# EAGLE design keybint (EAGLE 8.3.1)
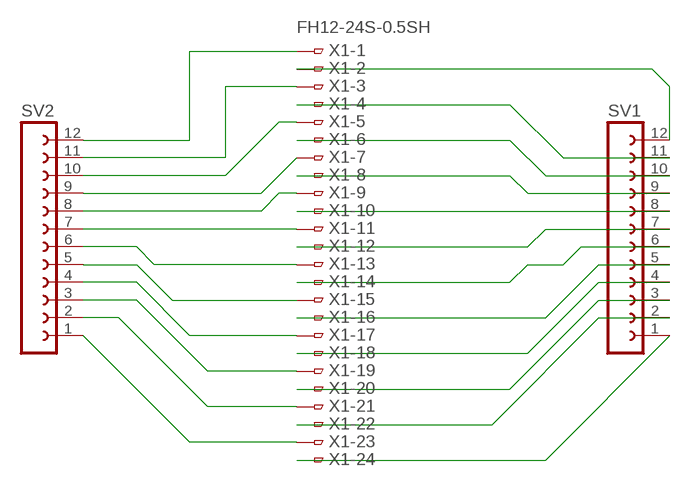
[diagram p0: schematic, sheet 1]

## Parts
SV1  FE12-1  [FE12]
SV2  FE12-1  [FE12]
X1  FH12-24S-0.5SH  [FH12-24S-0.5SH]

## Nets
N$1: SV2.12 X1.1
N$2: SV1.12 X1.2
N$3: SV2.11 X1.3
N$4: SV1.11 X1.4
N$5: SV2.10 X1.5
N$6: SV1.10 X1.6
N$7: SV2.9 X1.7
N$8: SV1.9 X1.8
N$9: SV2.8 X1.9
N$10: SV1.8 X1.10
N$11: SV2.7 X1.11
N$12: SV1.7 X1.12
N$13: SV2.6 X1.13
N$14: SV1.6 X1.14
N$15: SV2.5 X1.15
N$16: SV1.5 X1.16
N$17: SV2.4 X1.17
N$18: SV1.4 X1.18
N$19: SV2.3 X1.19
N$20: SV1.3 X1.20
N$21: SV2.2 X1.21
N$22: SV1.2 X1.22
N$23: SV2.1 X1.23
N$24: SV1.1 X1.24

## Library data of the parts
SV1 SV2 = con-lsta:FE12-1: FEMALE HEADER; OC_FARNELL: unknown; OC_NEWARK: unknown
X1 = con-hirose:FH12-24S-0.5S: 0.5mm Pitch Connectors For FPC/FFC Source: Data sheet <http://www.hirose.co.jp/cataloge_hp/e58605370.pdf>; MPN: FH12-24S-0.5SH(55); OC_FARNELL: 1324552; OC_NEWARK: 34M6170

## Board
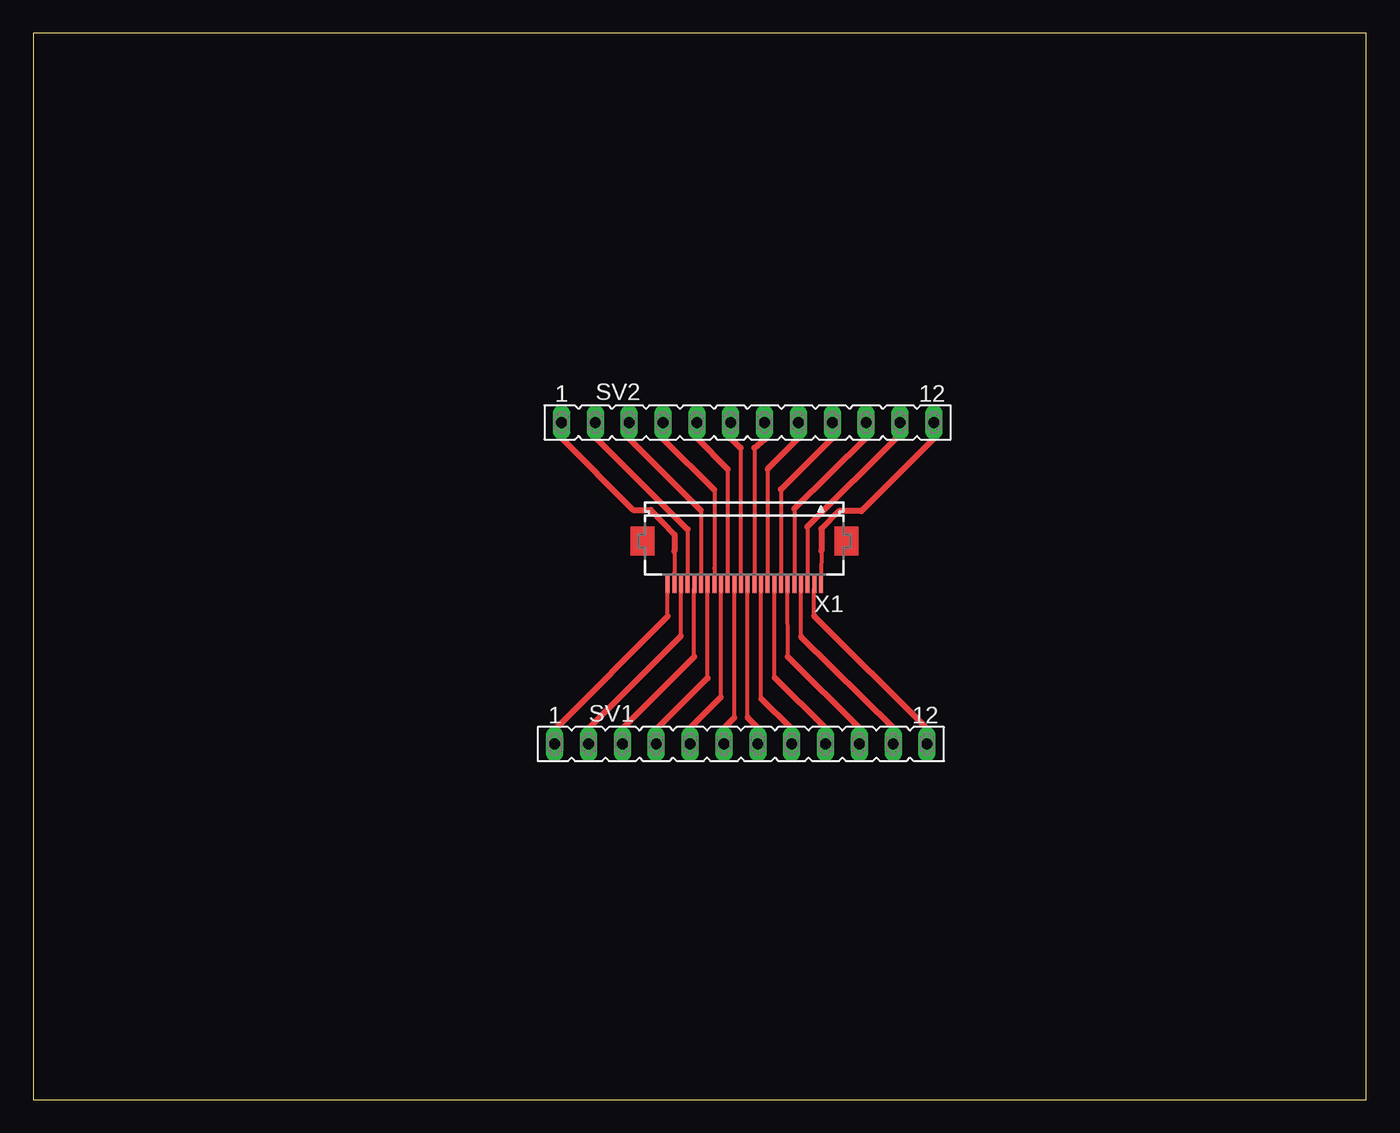
[diagram p1: board, top side]

Size 100 x 80 mm. Coordinates in mm from the lower left corner, seen from the top.
Outline: 0,0 100,0 100,80 0,80 0,0
Copper layers (1*16): Top 0.035mm / dielectric 1.5mm / Bottom 0.035mm
Design rules "default *": minimum track width 12mil, minimum drill 0.35mm, track to track 1mil, track to pad 1mil, pad to pad 1mil, via to via 1mil, smd to smd 1mil, copper to edge 40mil, drill to drill 6mil, minimum pad ring 10mil, minimum via ring 8mil, stop-mask expansion 4mil, vias tented up to drill 0mil, thermal gap 10mil

### Footprints (pad centres in the part's own frame; a part is rotated, then mirrored left to right if it is on the bottom)
FE12 = drill 0.813 long: 1 -13.97,0; 2 -11.43,0; 3 -8.89,0; 4 -6.35,0; 5 -3.81,0; 6 -1.27,0; 7 1.27,0; 8 3.81,0; 9 6.35,0; 10 8.89,0; 11 11.43,0; 12 13.97,0
FH12-24S-0.5SH = smd 0.3 x 1.3: 1 -5.75,3.25; 2 -5.25,3.25; 3 -4.75,3.25; 4 -4.25,3.25; 5 -3.75,3.25; 6 -3.25,3.25; 7 -2.75,3.25; 8 -2.25,3.25; 9 -1.75,3.25; 10 -1.25,3.25; 11 -0.75,3.25; 12 -0.25,3.25; 13 0.25,3.25; 14 0.75,3.25; 15 1.25,3.25; 16 1.75,3.25; 17 2.25,3.25; 18 2.75,3.25; 19 3.25,3.25; 20 3.75,3.25; 21 4.25,3.25; 22 4.75,3.25; 23 5.25,3.25; 24 5.75,3.25

### Placement (x,y rotation side)
SV1  53.09,26.67 0 top
SV2  53.59,50.8 0 top
X1  53.34,41.91 180 top

### Tracks (layer width: path | path; a pad name or v marks a point on that pad's centre or on a via)
N$1
  Top 0.305: 59.13,41.16 59.11,39.31 X1.1 | 67.55,49.58 SV2.12
  Top 0.457: 67.55,49.58 62.13,44.15 60.45,44.15 59.13,42.82 59.13,41.16
N$2
  Top 0.305: 58.59,36.28 58.59,38.1 X1.2 | 67.06,27.84 SV1.12
  Top 0.457: 67.06,27.84 58.59,36.28
N$3
  Top 0.305: 58.06,42.98 58.09,39.41 X1.3 | 64.99,49.87 SV2.11
  Top 0.457: 64.99,49.87 58.06,42.98
N$4
  Top 0.305: 57.59,34.71 57.59,38.08 X1.4 | 64.52,27.86 SV1.11
  Top 0.457: 64.52,27.86 57.59,34.71
N$5
  Top 0.305: 57.1,44.34 57.1,39.38 X1.5 | 62.46,49.64 SV2.10
  Top 0.457: 62.46,49.64 57.1,44.34
N$6
  Top 0.305: 56.6,33.22 56.58,38.1 X1.6 | 61.99,27.86 SV1.10
  Top 0.457: 61.99,27.86 56.6,33.22
N$7
  Top 0.305: 56.08,45.77 56.08,39.46 X1.7 | 59.93,49.59 SV2.9
  Top 0.457: 59.93,49.59 56.08,45.77
N$8
  Top 0.305: 55.61,31.66 55.61,38.1 X1.8 | 59.44,27.86 SV1.9
  Top 0.457: 59.44,27.86 55.61,31.66
N$9
  Top 0.305: 55.09,47.3 55.09,39.36 X1.9 | SV2.8 57.4,50.67 57.38,49.58
  Top 0.457: 57.38,49.58 55.09,47.3
N$10
  Top 0.305: 54.6,30.09 54.6,38.08 X1.10 | 56.9,27.84 SV1.8
  Top 0.457: 56.9,27.84 54.6,30.09
N$11
  Top 0.305: 54.1,48.88 54.1,39.43 X1.11 | 54.86,49.52 SV2.7
  Top 0.457: 54.86,49.52 54.1,48.88
N$12
  Top 0.305: 53.58,28.68 53.58,38.08 X1.12 | 54.37,27.89 SV1.7
  Top 0.457: 54.37,27.89 53.58,28.68
N$13
  Top 0.305: 53.07,48.88 53.07,39.38 X1.13 | 52.34,49.59 SV2.6
  Top 0.457: 52.34,49.59 53.07,48.88
N$14
  Top 0.305: 52.6,28.65 52.6,38.1 X1.14 | 51.82,27.86 SV1.6
  Top 0.457: 51.82,27.86 52.6,28.65
N$15
  Top 0.305: 52.08,47.3 52.08,39.38 X1.15 | 49.81,49.62 SV2.5
  Top 0.457: 49.81,49.62 52.08,47.3
N$16
  Top 0.305: 51.59,30.19 51.59,38.1 X1.16 | 49.26,27.86 SV1.5
  Top 0.457: 49.26,27.86 51.59,30.19
N$17
  Top 0.305: 51.09,45.73 51.09,39.87 X1.17 | 47.23,49.57 SV2.4
  Top 0.457: 47.23,49.57 51.09,45.73
N$18
  Top 0.305: 50.6,31.62 50.6,38.08 X1.18 | 46.74,27.76 SV1.4
  Top 0.457: 46.74,27.76 50.6,31.62
N$19
  Top 0.305: 50.08,44.21 50.08,39.51 X1.19 | 44.74,49.54 SV2.3
  Top 0.457: 44.74,49.54 50.08,44.21
N$20
  Top 0.305: 49.58,33.22 49.58,38.08 X1.20 | 44.17,27.81 SV1.3
  Top 0.457: 44.17,27.81 49.58,33.22
N$21
  Top 0.305: 49.09,42.77 49.09,38.62 X1.21 | 42.16,49.67 SV2.2
  Top 0.457: 42.16,49.67 49.09,42.77
N$22
  Top 0.305: 48.59,34.78 48.59,38.1 X1.22 | 41.64,27.84 SV1.2
  Top 0.457: 41.64,27.84 48.59,34.78
N$23
  Top 0.305: 48.09,41.15 48.09,39.53 X1.23 | 39.62,49.62 SV2.1
  Top 0.457: 39.62,49.62 45.01,44.25 46.33,44.25 48.11,42.39 48.09,41.15
N$24
  Top 0.305: 47.6,36.26 47.6,38 X1.24 | 39.13,27.76 SV1.1
  Top 0.457: 39.13,27.76 47.6,36.26